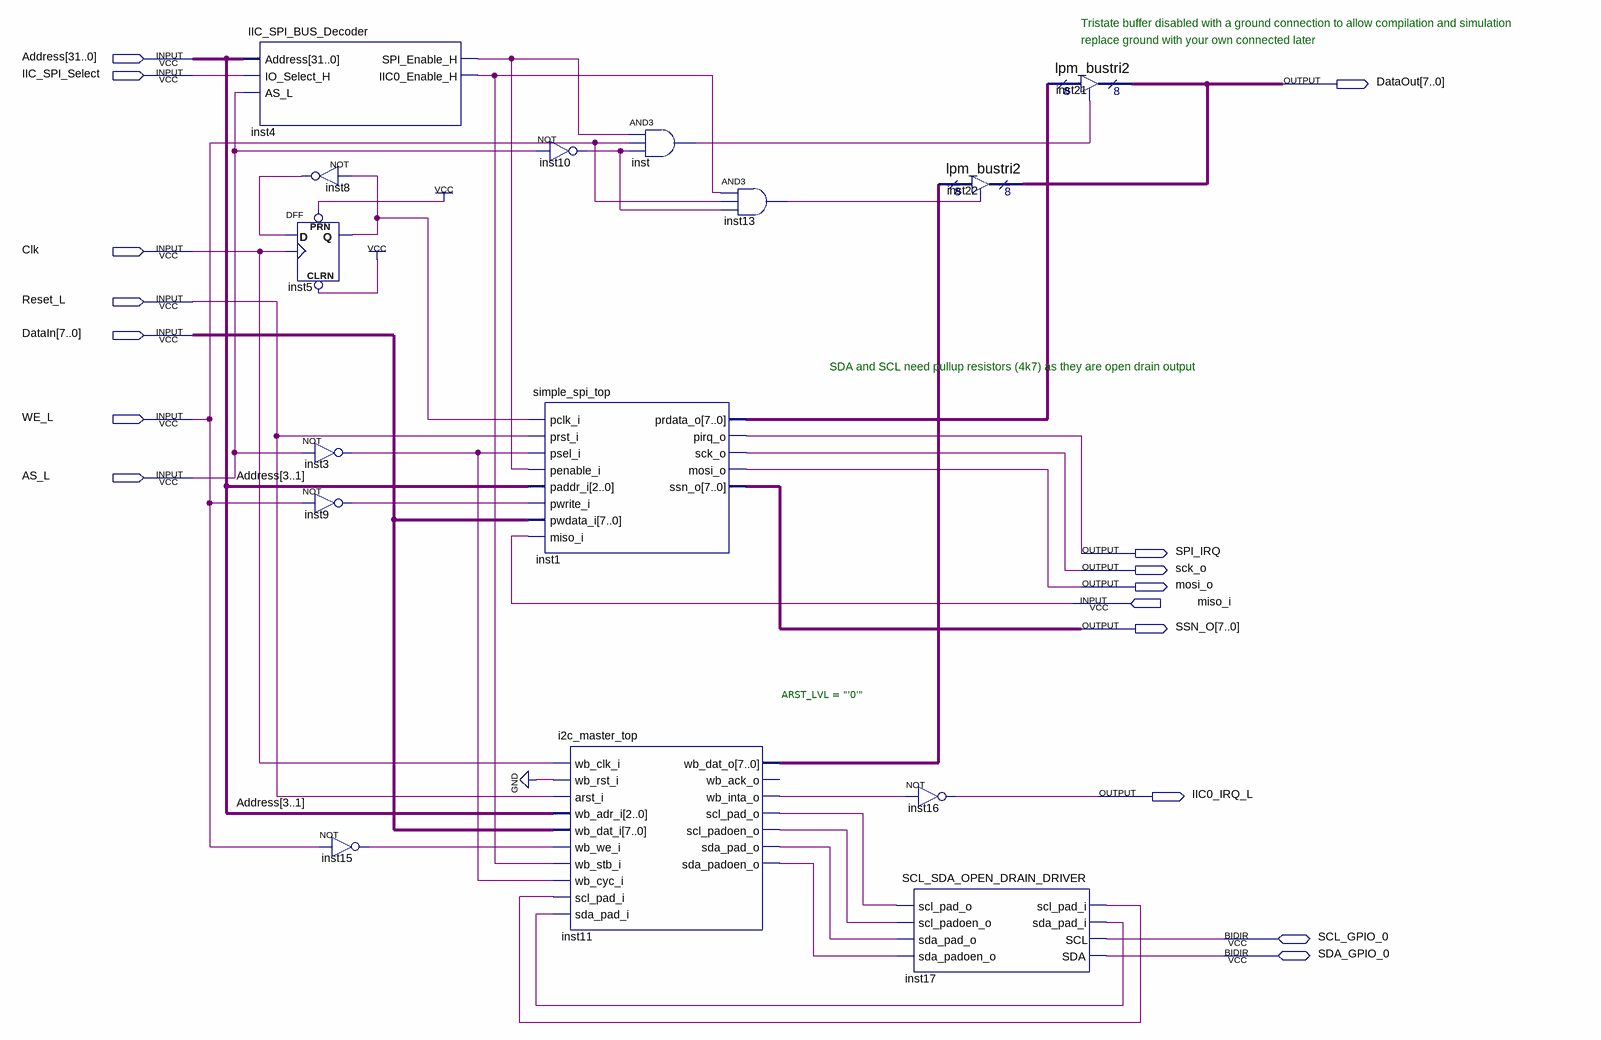
[diagram p0: schematic sheet]
// Quartus schematic IIC_SPI_Interface.bdf as structural Verilog: 15 symbols, 16 pins
module IIC_SPI_Interface (
  input  [31:0] Address,
  input  IIC_SPI_Select,
  input  Clk,
  input  Reset_L,
  input  [7:0] DataIn,
  input  WE_L,
  input  AS_L,
  input  miso_i,
  inout  SCL_GPIO_0,
  inout  SDA_GPIO_0,
  output [7:0] DataOut,
  output SPI_IRQ,
  output sck_o,
  output mosi_o,
  output [7:0] SSN_O,
  output IIC0_IRQ_L
);

  wire inst3_out, inst4_iic0_enable_h, inst4_spi_enable_h, inst5_q, inst8_out, inst9_out, inst10_out,
       inst11_scl_pad_o, inst11_scl_padoen_o, inst11_sda_pad_o, inst11_sda_padoen_o, inst11_wb_inta_o,
       inst13_out, inst15_out, inst17_scl_pad_i, inst17_sda_pad_i, inst_out;
  wire [7:0] inst1_prdata_o, inst11_wb_dat_o;

  IIC_SPI_BUS_Decoder inst4 (
    .Address(Address), .IO_Select_H(IIC_SPI_Select), .AS_L(AS_L), .SPI_Enable_H(inst4_spi_enable_h),
    .IIC0_Enable_H(inst4_iic0_enable_h));
  not inst8 (inst8_out, inst5_q);
  DFF inst5 (.CLRN(1'b1), .CLK(Clk), .D(inst8_out), .PRN(1'b1), .Q(inst5_q));
  not inst3 (inst3_out, AS_L);
  not inst9 (inst9_out, WE_L);
  not inst15 (inst15_out, WE_L);
  not inst10 (inst10_out, AS_L);
  simple_spi_top inst1 (
    .pclk_i(inst5_q), .prst_i(Reset_L), .psel_i(inst3_out), .penable_i(inst4_spi_enable_h),
    .paddr_i(Address[3:1]), .pwrite_i(inst9_out), .pwdata_i(DataIn), .miso_i(miso_i),
    .prdata_o(inst1_prdata_o), .pirq_o(SPI_IRQ), .sck_o(sck_o), .mosi_o(mosi_o), .ssn_o(SSN_O));
  i2c_master_top #(.ARST_LVL("'0'")) inst11 (
    .wb_clk_i(Clk), .wb_rst_i(1'b0), .arst_i(Reset_L), .wb_adr_i(Address[3:1]), .wb_dat_i(DataIn),
    .wb_we_i(inst15_out), .wb_stb_i(inst4_iic0_enable_h), .wb_cyc_i(inst3_out), .scl_pad_i(inst17_scl_pad_i),
    .sda_pad_i(inst17_sda_pad_i), .wb_dat_o(inst11_wb_dat_o), .wb_inta_o(inst11_wb_inta_o),
    .scl_pad_o(inst11_scl_pad_o), .scl_padoen_o(inst11_scl_padoen_o), .sda_pad_o(inst11_sda_pad_o),
    .sda_padoen_o(inst11_sda_padoen_o));  // open: wb_ack_o
  and inst (inst_out, inst4_spi_enable_h, WE_L, inst10_out);
  and inst13 (inst13_out, inst4_iic0_enable_h, WE_L, inst10_out);
  lpm_bustri2 inst22 (.enabledt(inst13_out), .data(inst11_wb_dat_o), .tridata(DataOut));
  not inst16 (IIC0_IRQ_L, inst11_wb_inta_o);
  SCL_SDA_OPEN_DRAIN_DRIVER inst17 (
    .scl_pad_o(inst11_scl_pad_o), .scl_padoen_o(inst11_scl_padoen_o), .sda_pad_o(inst11_sda_pad_o),
    .sda_padoen_o(inst11_sda_padoen_o), .scl_pad_i(inst17_scl_pad_i), .sda_pad_i(inst17_sda_pad_i),
    .SCL(SCL_GPIO_0), .SDA(SDA_GPIO_0));
  lpm_bustri2 inst21 (.enabledt(inst_out), .data(inst1_prdata_o), .tridata(DataOut));

  // Notes on the sheet:
  //   Tristate buffer disabled with a ground connection to allow compilation and simulation
  //   replace ground with your own connected later
  //   SDA and SCL need pullup resistors (4k7) as they are open drain output
endmodule
